# EasyEDA schematic drone.json
TITLE: Drone; REV: 1.0; Date: 2019-06-03; Sheet: 1/1; Drawn By: abdelhalem; Company: ?
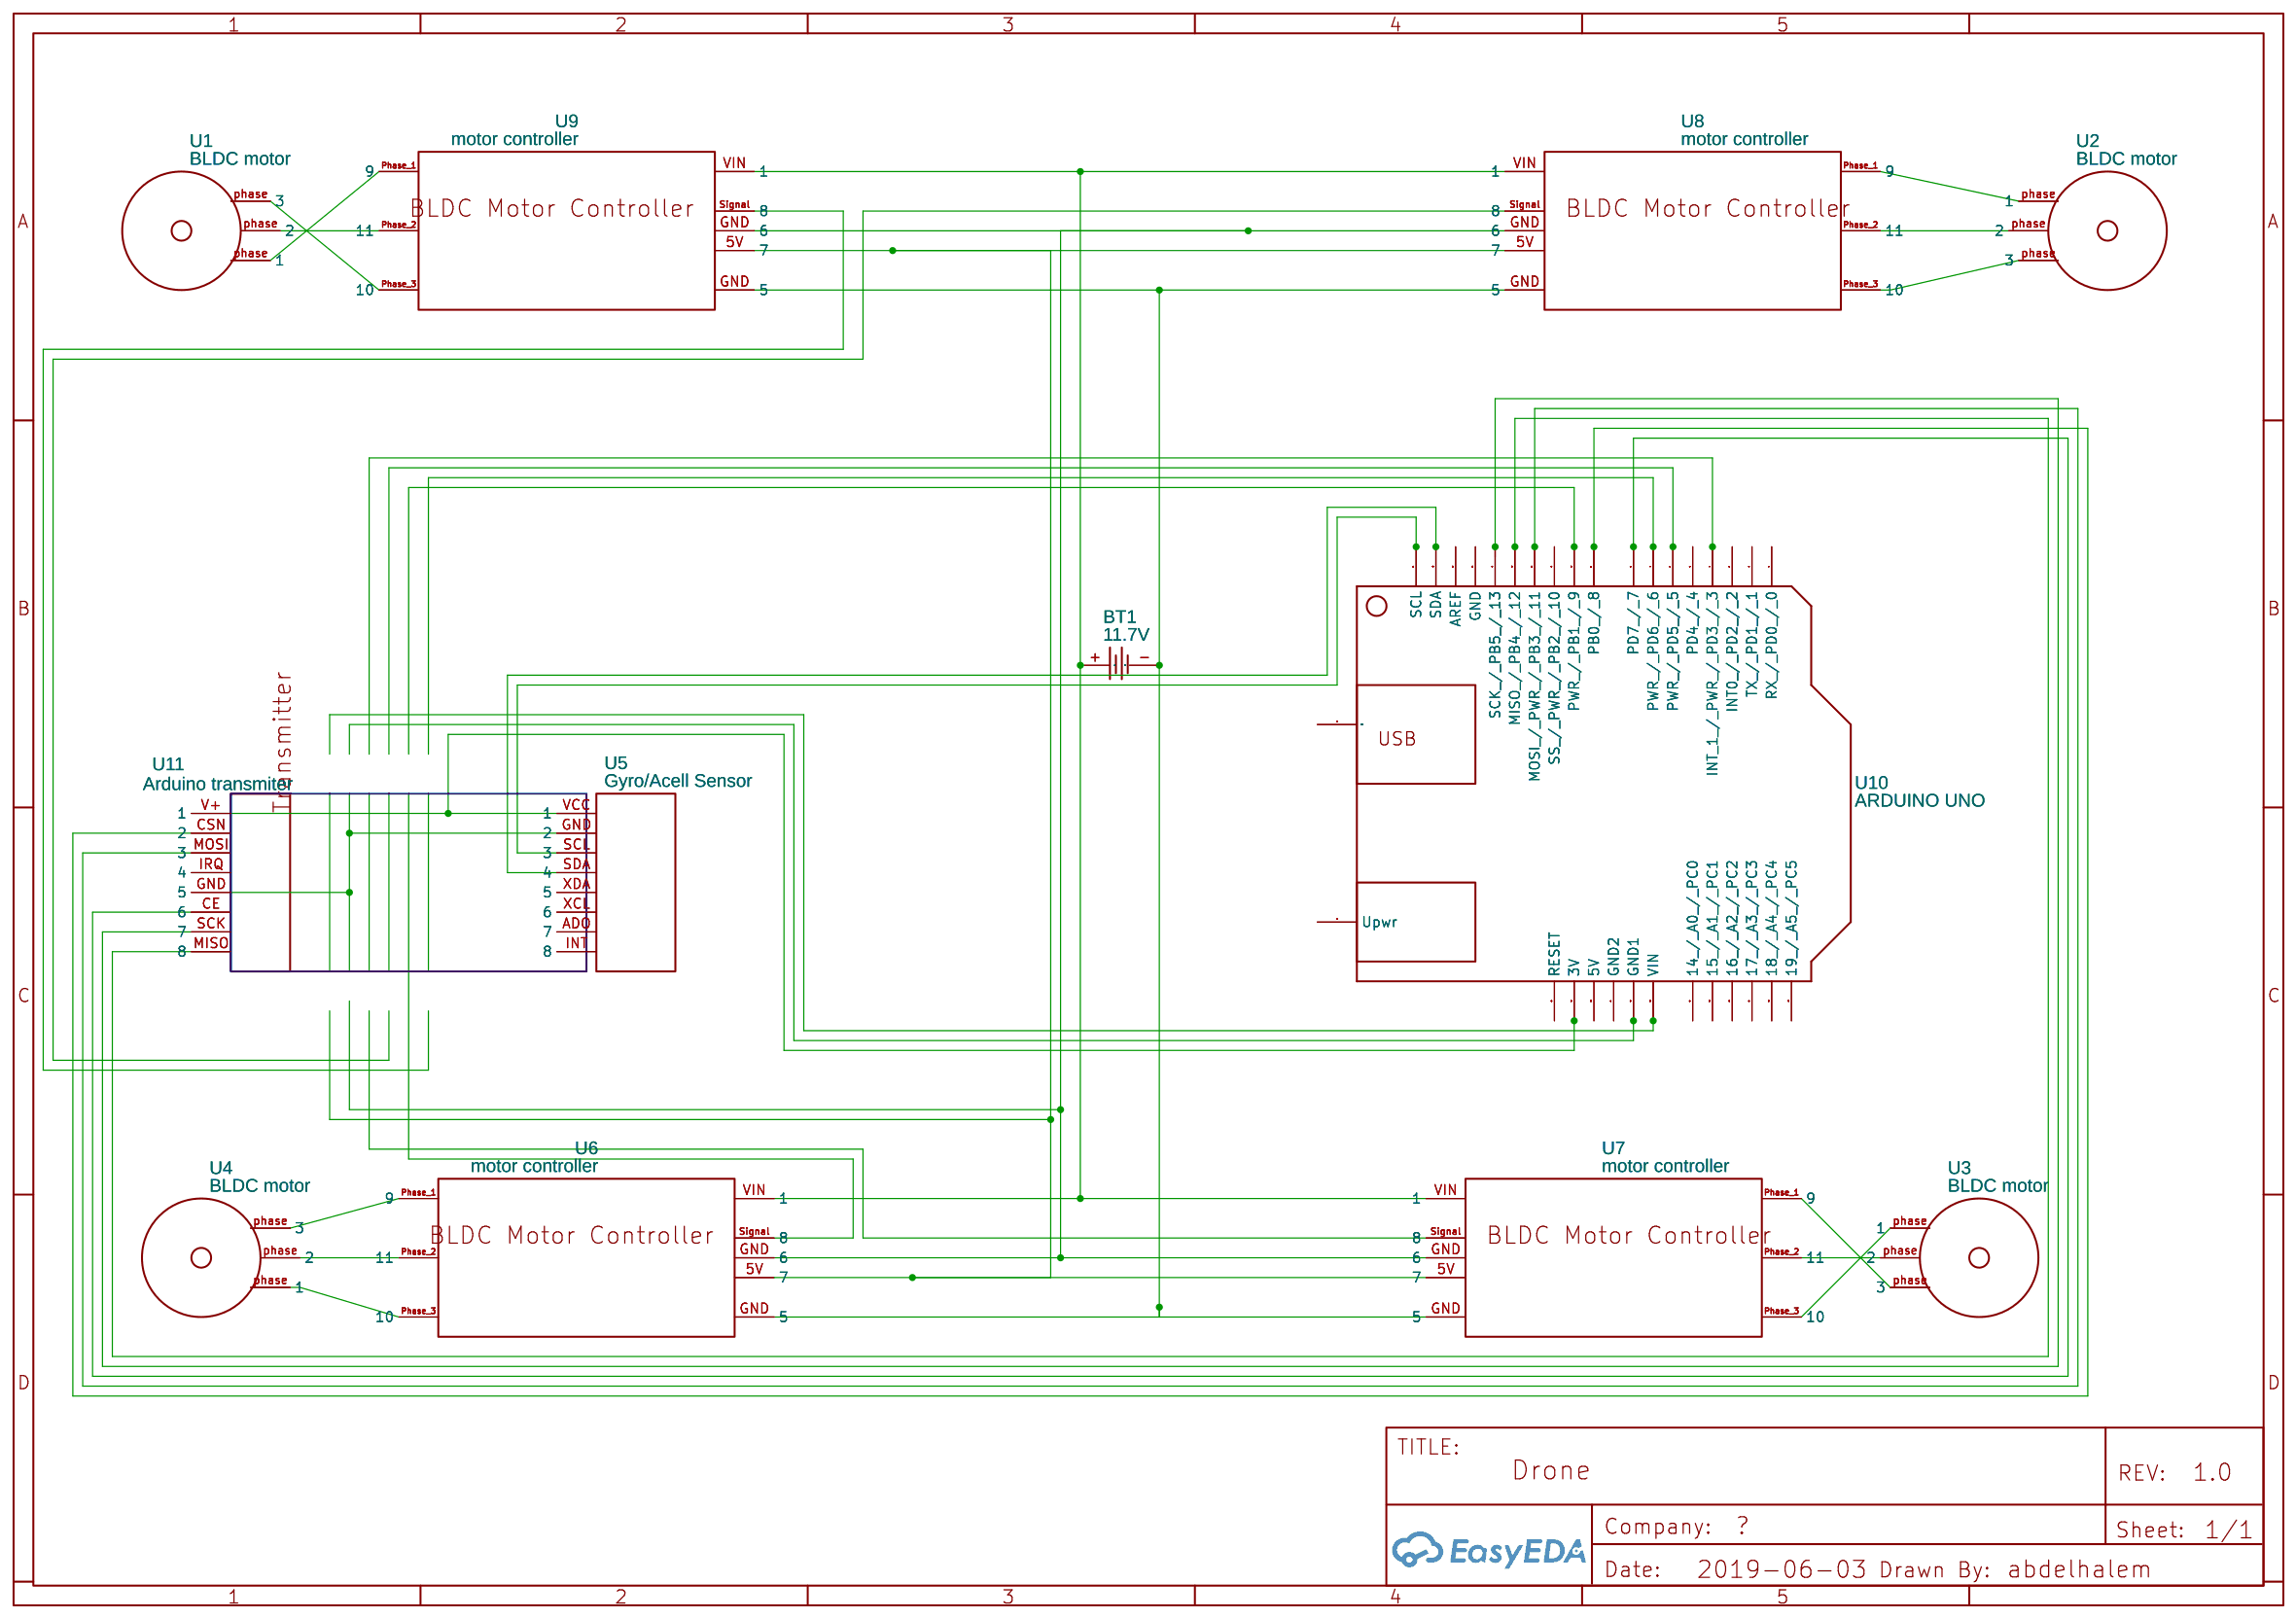
[diagram p0: schematic sheet]

## Parts
BT1  11.7V  [BATTERY-2]
U1  BLDC motor
U2  BLDC motor
U3  BLDC motor
U4  BLDC motor
U5  Gyro/Acell Sensor
U6  motor controller
U7  motor controller
U8  motor controller
U9  motor controller
U10  ARDUINO UNO  [ARDUINO UNO S]
U11  Arduino transmiter

## Library data of the parts
BT1 = -: Supplier: LCSC; Supplier Part: C238068; Manufacturer: Keystone; Manufacturer Part: 1056TR; Contributor: LCSC
U1-U9 U11 = -: Manufacturer Part: ?; Contributor: abdelhalem
U10 = -: catid: 20; Contributor: Adafruit; sourceId: UuoGASa4m; Manufacturer Part: ?

## Nets
Net-(BT1-+): BT1.+(1) U6.VIN(1) U7.VIN(1) U8.VIN(1) U9.VIN(1)
Net-(BT1--): BT1.-(2) U6.GND(6) U7.GND(6) U8.GND(6) U9.GND(6)
Net-(U1-phase): U1.phase(3) U9.Phase 1(9) U9.Phase 2(11) U9.Phase 3(10)
Net-(U2-phase): U2.phase(3) U8.Phase 1(9) U8.Phase 2(11) U8.Phase 3(10)
Net-(U3-phase): U3.phase(3) U7.Phase 1(9) U7.Phase 2(11) U7.Phase 3(10)
Net-(U5-GND): U5.GND(2) U11.GND(5)
Net-(U5-VCC): U5.VCC(1) U10.29(3V) U11.V+(1)
Net-(U6-5V): U6.5V(7) U7.5V(7) U8.5V(7)
Net-(U10-8): U10.8(PD7 / 7) U11.CE(6)
Net-(U10-9): U10.9(PB0 / 8) U11.CSN(2)
Net-(U10-12): U10.12(MOSI / PWR / PB3 / 11) U11.MOSI(3)
Net-(U10-13): U10.13(MISO / PB4 / 12) U11.MISO(8)
Net-(U10-14): U10.14(SCK / PB5 / 13) U11.SCK(7)

Not connected (* = marked no-connect by the designer): U4 phase(3); U5 ADO(7) INT(8) SCL(3) SDA(4) XCL(6) XDA(5); U6 Phase 1(9) Phase 2(11) Phase 3(10) Signal(8); U7 Signal(8); U8 Signal(8); U9 5V(7) Signal(8); U10 1(RX / PD0 / 0) 2(TX / PD1 / 1) 3(INT0 / PD2 / 2) 4(INT 1 / PWR / PD3 / 3) 5(PD4 / 4) 6(PWR / PD5 / 5) 7(PWR / PD6 / 6) 10(PWR / PB1 / 9) 11(SS / PWR / PB2 / 10) 15(GND) 16(AREF) 19(19 / A5 / PC5) 20(18 / A4 / PC4) 21(17 / A3 / PC3) 22(16 / A2 / PC2) 23(15 / A1 / PC1) 24(14 / A0 / PC0) 25(VIN) 26(GND1) 27(GND2) 28(5V) 30(SDA) 31(SCL) 32(Upwr) 33(USB); U11 IRQ(4)
